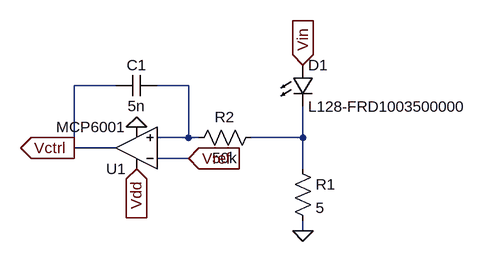
[diagram p0: schematic expt3_schema.asc]
expt3_schema.asc, the LTspice schematic file:
Version 4
SHEET 1 880 680
WIRE -16 32 -80 32
WIRE 96 32 48 32
WIRE 96 112 96 32
WIRE 96 112 48 112
WIRE 112 112 96 112
WIRE 272 112 272 64
WIRE 272 112 192 112
WIRE -80 128 -80 32
WIRE -16 128 -80 128
WIRE 96 144 48 144
WIRE 272 160 272 112
WIRE 272 256 272 240
FLAG 272 256 0
FLAG 16 96 0
FLAG 96 144 Vref
IOPIN 96 144 In
FLAG 16 160 Vdd
IOPIN 16 160 In
FLAG -80 128 Vctrl
IOPIN -80 128 Out
FLAG 272 0 Vin
IOPIN 272 0 In
SYMBOL res 256 144 R0
SYMATTR InstName R1
SYMATTR Value 5
SYMBOL res 208 96 R90
WINDOW 0 0 56 VBottom 2
WINDOW 3 32 56 VTop 2
SYMATTR InstName R2
SYMATTR Value 50k
SYMBOL cap 48 16 R90
WINDOW 0 0 32 VBottom 2
WINDOW 3 32 32 VTop 2
SYMATTR InstName C1
SYMATTR Value 5n
SYMBOL MCP6001 16 128 R180
SYMATTR InstName U1
SYMBOL LED 256 0 R0
SYMATTR InstName D1
SYMATTR Value L128-FRD1003500000

The netlist it stands for:
* expt3_schema.asc
R1 N002 0 5
R2 N002 N001 50k
C1 N001 Vctrl 5n
* U1: MCP6001 (symbol MCP6001 not available, pins judged from their places): In+=N001 In-=Vref V+=Vdd V-=0 OUT=Vctrl
D1 Vin N002 L128-FRD1003500000
.model D D
.lib standard.dio
.backanno
.end